# EAGLE design K84 (EAGLE 8.4.1)
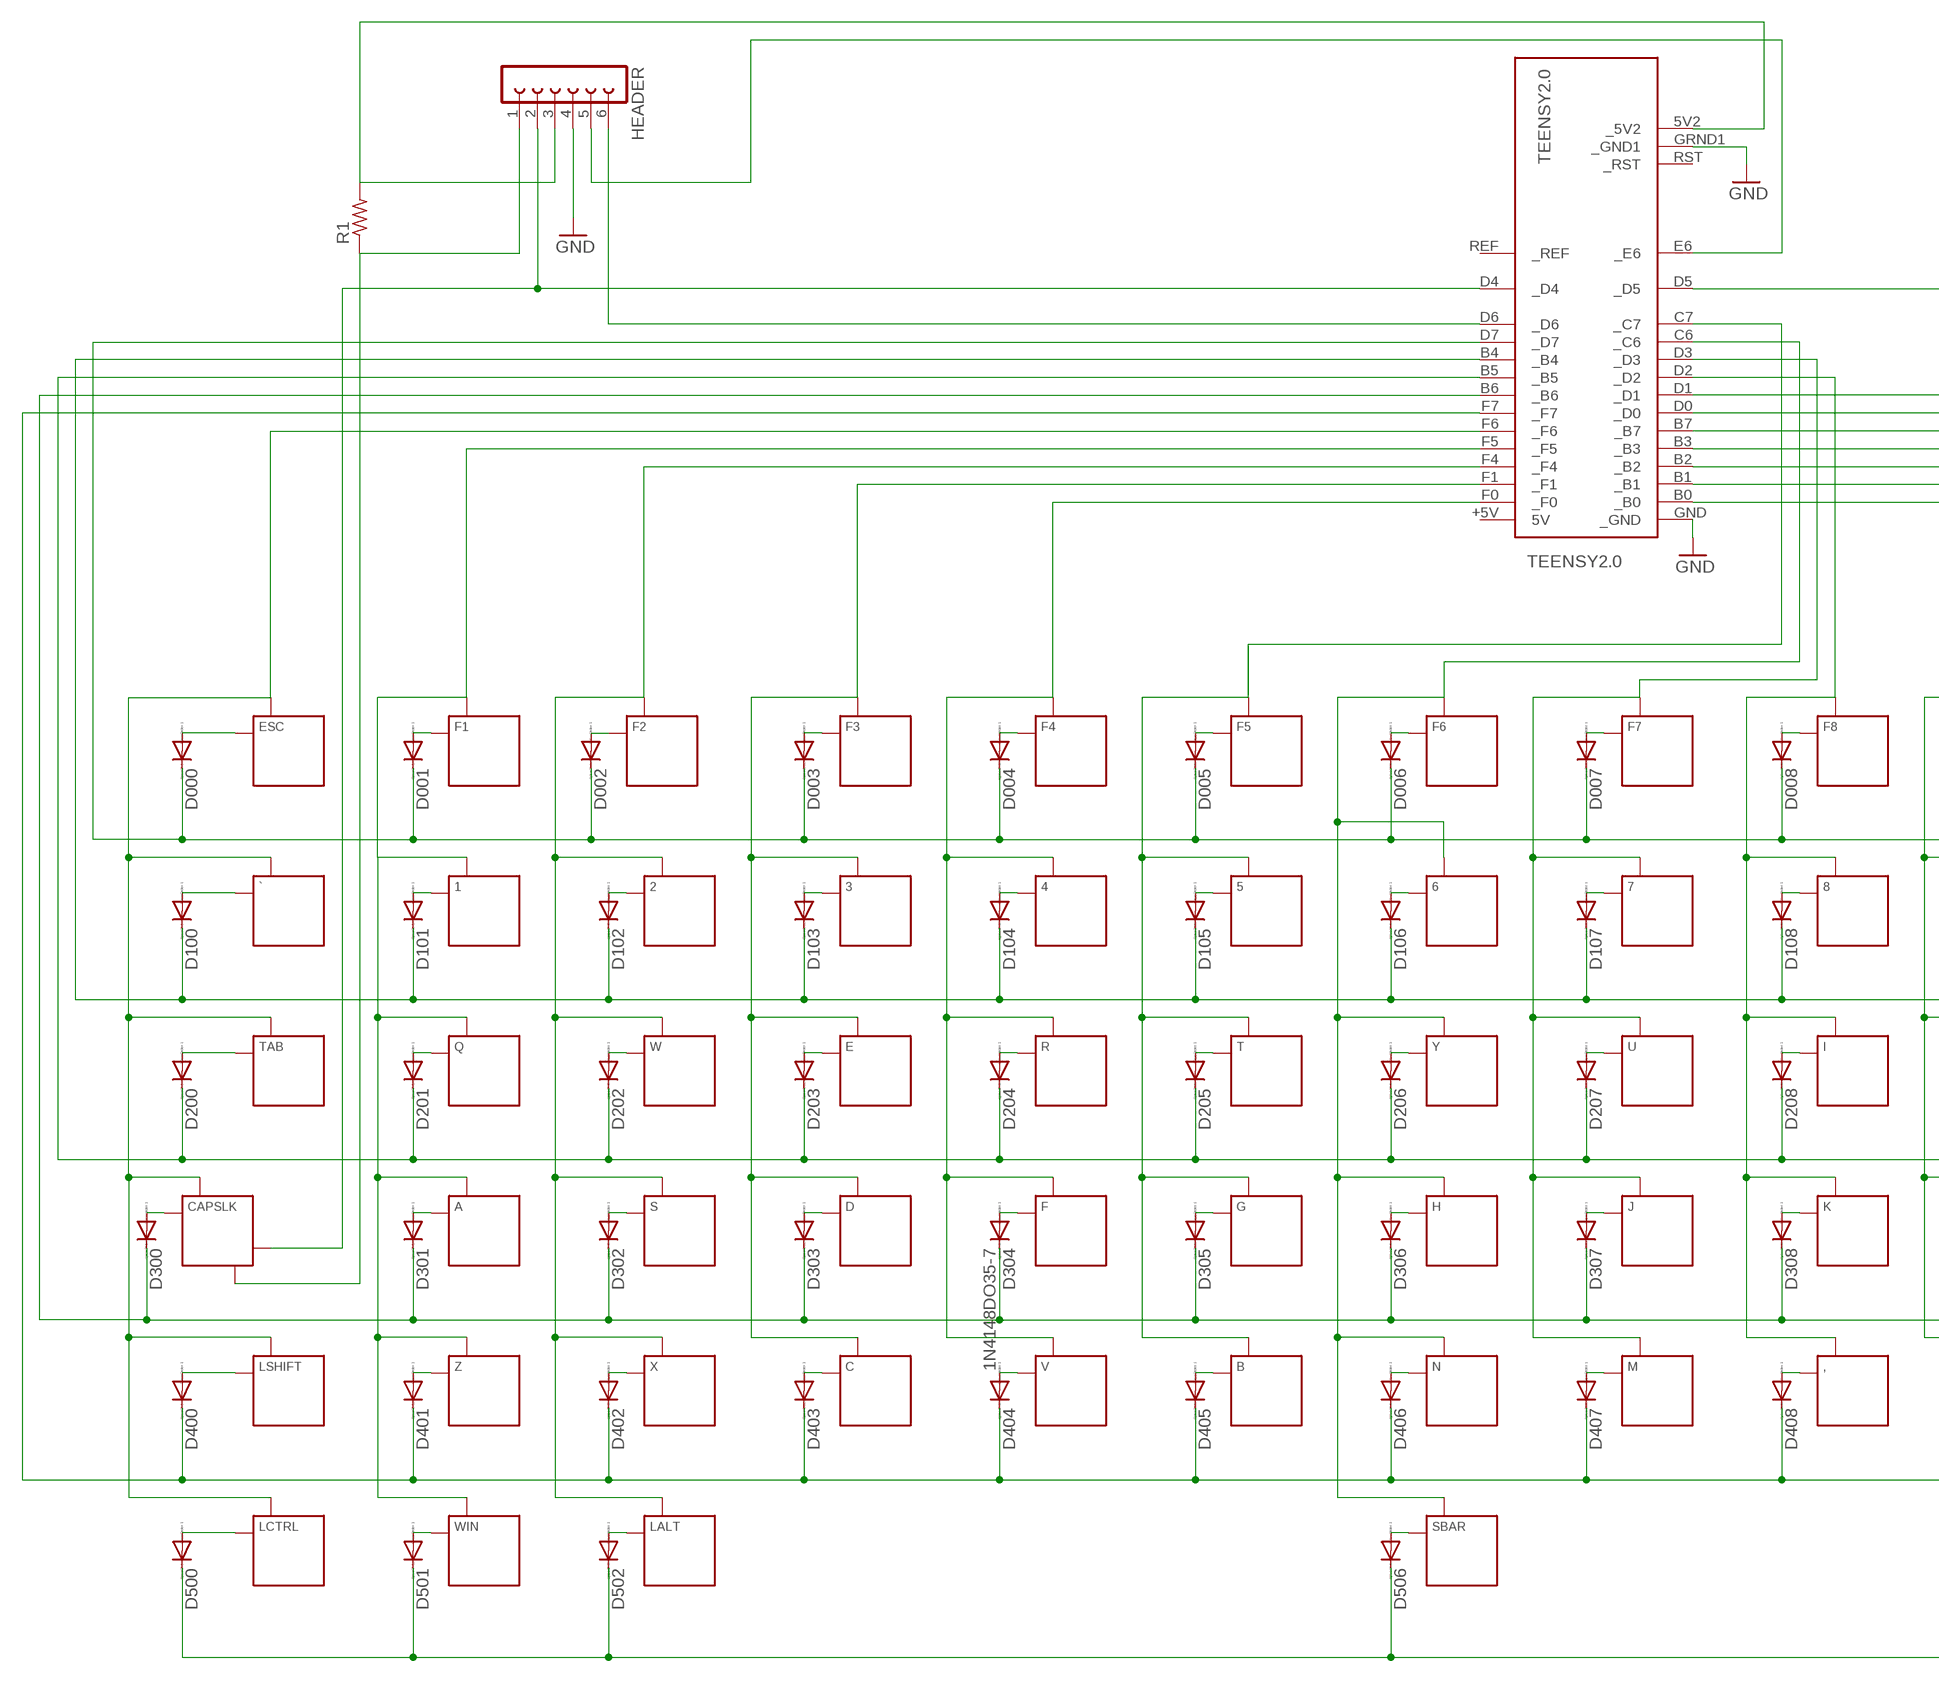
[diagram p0: schematic, sheet 1, part 1 of 2]
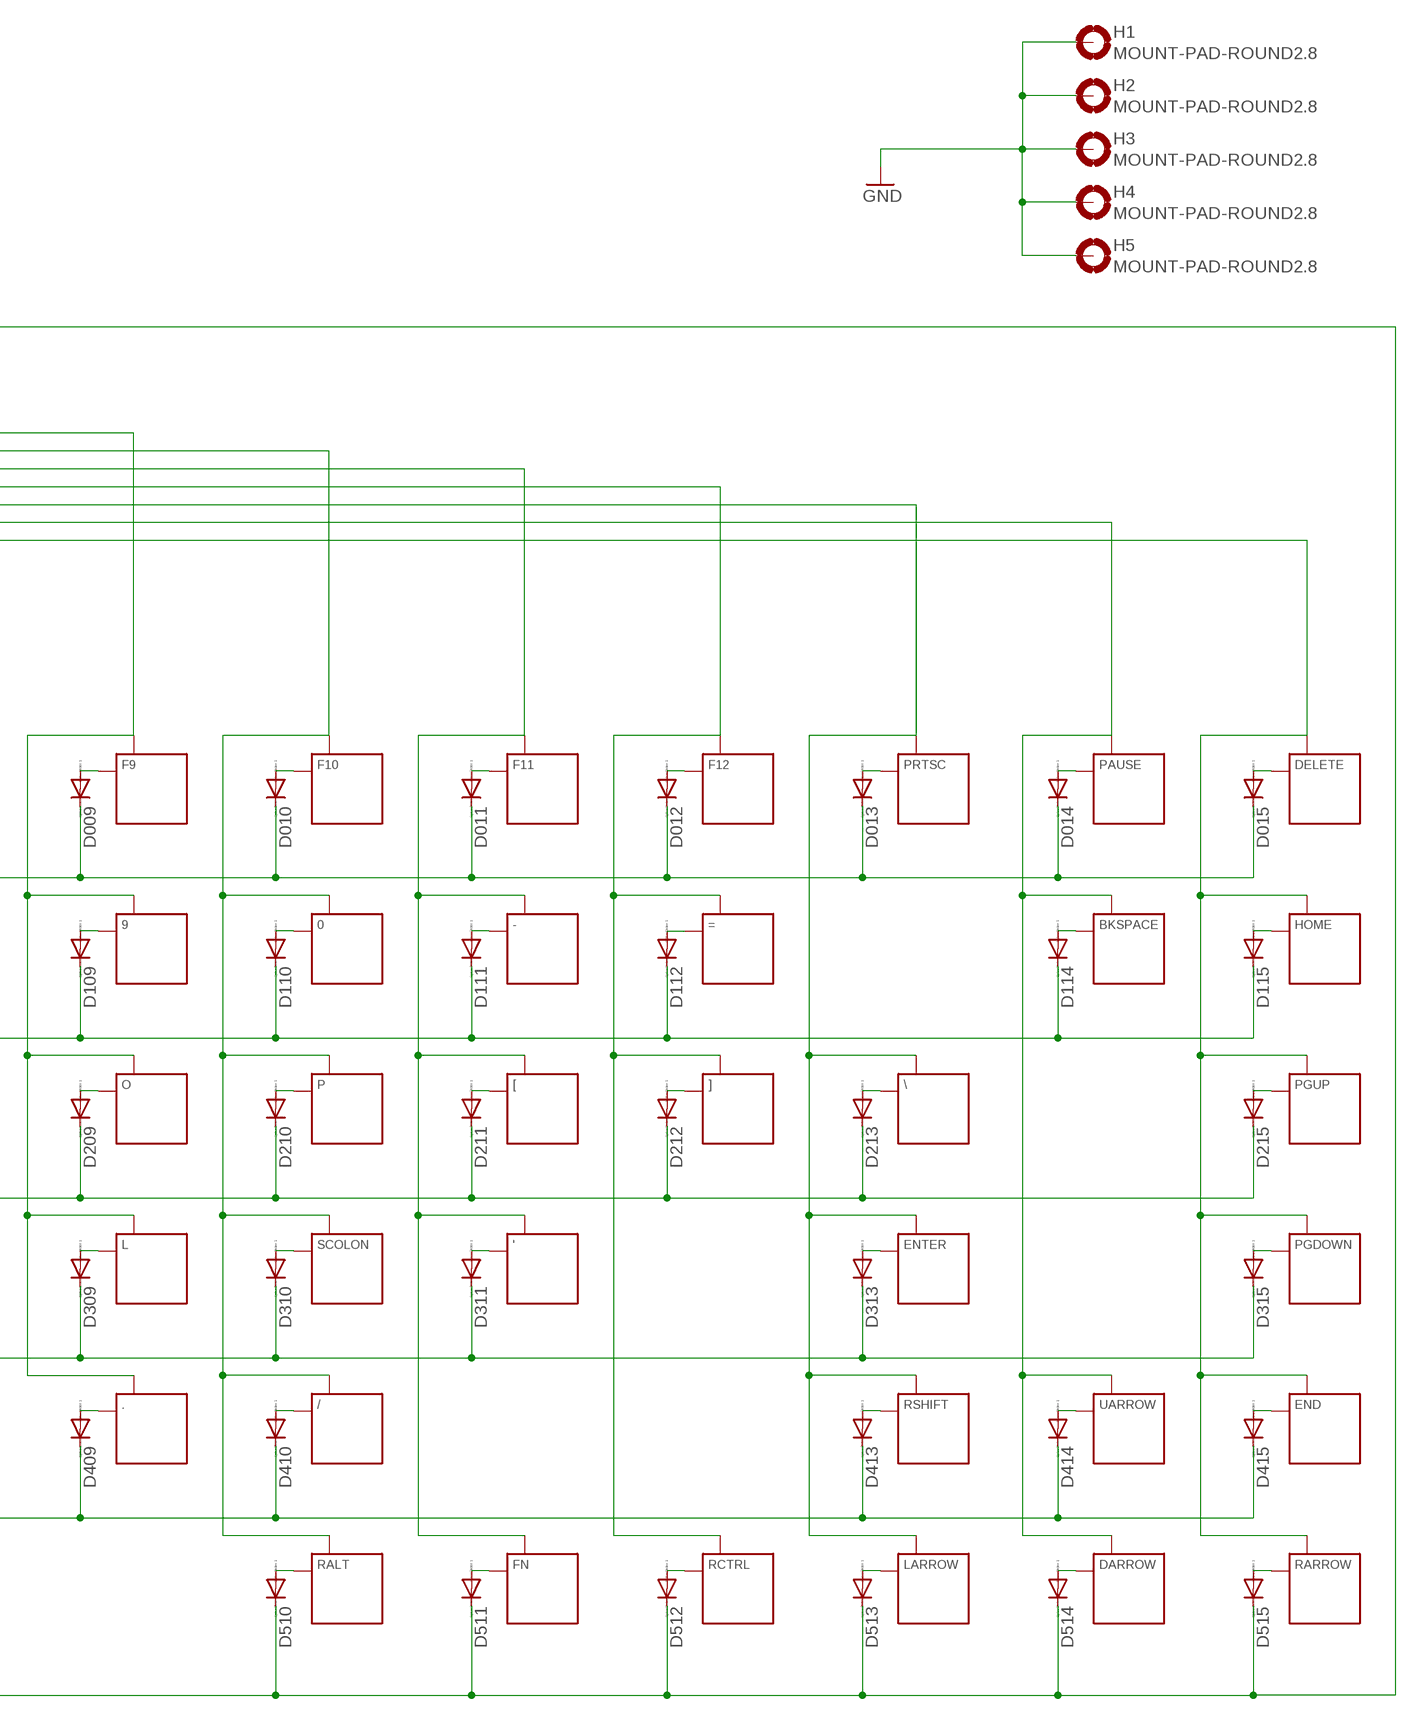
[diagram p1: schematic, sheet 1, part 2 of 2]

## Parts
0  KEYSWITCH-PLAIN-MX-1U  [MX-1U]
1  KEYSWITCH-PLAIN-MX-1U  [MX-1U]
2  KEYSWITCH-PLAIN-MX-1U  [MX-1U]
3  KEYSWITCH-PLAIN-MX-1U  [MX-1U]
4  KEYSWITCH-PLAIN-MX-1U  [MX-1U]
5  KEYSWITCH-PLAIN-MX-1U  [MX-1U]
6  KEYSWITCH-PLAIN-MX-1U  [MX-1U]
7  KEYSWITCH-PLAIN-MX-1U  [MX-1U]
8  KEYSWITCH-PLAIN-MX-1U  [MX-1U]
9  KEYSWITCH-PLAIN-MX-1U  [MX-1U]
'  KEYSWITCH-PLAIN-MX-1U  [MX-1U]
,  KEYSWITCH-PLAIN-MX-1U  [MX-1U]
-  KEYSWITCH-PLAIN-MX-1U  [MX-1U]
.  KEYSWITCH-PLAIN-MX-1U  [MX-1U]
/  KEYSWITCH-PLAIN-MX-1U  [MX-1U]
=  KEYSWITCH-PLAIN-MX-1U  [MX-1U]
[  KEYSWITCH-PLAIN-MX-1U  [MX-1U]
\\  KEYSWITCH-PLAIN-MX-1U  [MX-1U]
]  KEYSWITCH-PLAIN-MX-1U  [MX-1U]
`  KEYSWITCH-PLAIN-MX-1U  [MX-1U]
A  KEYSWITCH-PLAIN-MX-1U  [MX-1U]
B  KEYSWITCH-PLAIN-MX-1U  [MX-1U]
BKSPACE  KEYSWITCH-PLAIN-MX-2U  [MX-2U]
C  KEYSWITCH-PLAIN-MX-1U  [MX-1U]
CAPSLK  KEYSWITCH-LED-MX-1U-LED  [MX-1U-LED]
D  KEYSWITCH-PLAIN-MX-1U  [MX-1U]
D000  1N4148DO35-7  [DO35-7]
D001  1N4148DO35-7  [DO35-7]
D002  1N4148DO35-7  [DO35-7]
D003  1N4148DO35-7  [DO35-7]
D004  1N4148DO35-7  [DO35-7]
D005  1N4148DO35-7  [DO35-7]
D006  1N4148DO35-7  [DO35-7]
D007  1N4148DO35-7  [DO35-7]
D008  1N4148DO35-7  [DO35-7]
D009  1N4148DO35-7  [DO35-7]
D010  1N4148DO35-7  [DO35-7]
D011  1N4148DO35-7  [DO35-7]
D012  1N4148DO35-7  [DO35-7]
D013  1N4148DO35-7  [DO35-7]
D014  1N4148DO35-7  [DO35-7]
D015  1N4148DO35-7  [DO35-7]
D100  1N4148DO35-7  [DO35-7]
D101  1N4148DO35-7  [DO35-7]
D102  1N4148DO35-7  [DO35-7]
D103  1N4148DO35-7  [DO35-7]
D104  1N4148DO35-7  [DO35-7]
D105  1N4148DO35-7  [DO35-7]
D106  1N4148DO35-7  [DO35-7]
D107  1N4148DO35-7  [DO35-7]
D108  1N4148DO35-7  [DO35-7]
D109  1N4148DO35-7  [DO35-7]
D110  1N4148DO35-7  [DO35-7]
D111  1N4148DO35-7  [DO35-7]
D112  1N4148DO35-7  [DO35-7]
D114  1N4148DO35-7  [DO35-7]
D115  1N4148DO35-7  [DO35-7]
D200  1N4148DO35-7  [DO35-7]
D201  1N4148DO35-7  [DO35-7]
D202  1N4148DO35-7  [DO35-7]
D203  1N4148DO35-7  [DO35-7]
D204  1N4148DO35-7  [DO35-7]
D205  1N4148DO35-7  [DO35-7]
D206  1N4148DO35-7  [DO35-7]
D207  1N4148DO35-7  [DO35-7]
D208  1N4148DO35-7  [DO35-7]
D209  1N4148DO35-7  [DO35-7]
D210  1N4148DO35-7  [DO35-7]
D211  1N4148DO35-7  [DO35-7]
D212  1N4148DO35-7  [DO35-7]
D213  1N4148DO35-7  [DO35-7]
D215  1N4148DO35-7  [DO35-7]
D300  1N4148DO35-7  [DO35-7]
D301  1N4148DO35-7  [DO35-7]
D302  1N4148DO35-7  [DO35-7]
D303  1N4148DO35-7  [DO35-7]
D304  1N4148DO35-7  [DO35-7]
D305  1N4148DO35-7  [DO35-7]
D306  1N4148DO35-7  [DO35-7]
D307  1N4148DO35-7  [DO35-7]
D308  1N4148DO35-7  [DO35-7]
D309  1N4148DO35-7  [DO35-7]
D310  1N4148DO35-7  [DO35-7]
D311  1N4148DO35-7  [DO35-7]
D313  1N4148DO35-7  [DO35-7]
D315  1N4148DO35-7  [DO35-7]
D400  1N4148DO35-7  [DO35-7]
D401  1N4148DO35-7  [DO35-7]
D402  1N4148DO35-7  [DO35-7]
D403  1N4148DO35-7  [DO35-7]
D404  1N4148DO35-7  [DO35-7]
D405  1N4148DO35-7  [DO35-7]
D406  1N4148DO35-7  [DO35-7]
D407  1N4148DO35-7  [DO35-7]
D408  1N4148DO35-7  [DO35-7]
D409  1N4148DO35-7  [DO35-7]
D410  1N4148DO35-7  [DO35-7]
D413  1N4148DO35-7  [DO35-7]
D414  1N4148DO35-7  [DO35-7]
D415  1N4148DO35-7  [DO35-7]
D500  1N4148DO35-7  [DO35-7]
D501  1N4148DO35-7  [DO35-7]
D502  1N4148DO35-7  [DO35-7]
D506  1N4148DO35-7  [DO35-7]
D510  1N4148DO35-7  [DO35-7]
D511  1N4148DO35-7  [DO35-7]
D512  1N4148DO35-7  [DO35-7]
D513  1N4148DO35-7  [DO35-7]
D514  1N4148DO35-7  [DO35-7]
D515  1N4148DO35-7  [DO35-7]
DARROW  KEYSWITCH-PLAIN-MX-1U  [MX-1U]
DELETE  KEYSWITCH-PLAIN-MX-1U  [MX-1U]
E  KEYSWITCH-PLAIN-MX-1U  [MX-1U]
END  KEYSWITCH-PLAIN-MX-1U  [MX-1U]
ENTER  KEYSWITCH-PLAIN-MX-2U  [MX-2U]
ESC  S001  KEYSWITCH-PLAIN-MX-1U  [MX-1U]
F  KEYSWITCH-PLAIN-MX-1U  [MX-1U]
F1  KEYSWITCH-PLAIN-MX-1U  [MX-1U]
F2  KEYSWITCH-PLAIN-MX-1U  [MX-1U]
F3  KEYSWITCH-PLAIN-MX-1U  [MX-1U]
F4  KEYSWITCH-PLAIN-MX-1U  [MX-1U]
F5  KEYSWITCH-PLAIN-MX-1U  [MX-1U]
F6  KEYSWITCH-PLAIN-MX-1U  [MX-1U]
F7  KEYSWITCH-PLAIN-MX-1U  [MX-1U]
F8  KEYSWITCH-PLAIN-MX-1U  [MX-1U]
F9  KEYSWITCH-PLAIN-MX-1U  [MX-1U]
F10  KEYSWITCH-PLAIN-MX-1U  [MX-1U]
F11  KEYSWITCH-PLAIN-MX-1U  [MX-1U]
F12  KEYSWITCH-PLAIN-MX-1U  [MX-1U]
FN  KEYSWITCH-PLAIN-MX-1U  [MX-1U]
G  KEYSWITCH-PLAIN-MX-1U  [MX-1U]
H  KEYSWITCH-PLAIN-MX-1U  [MX-1U]
H1  MOUNT-PAD-ROUND2.8  [2,8-PAD]
H2  MOUNT-PAD-ROUND2.8  [2,8-PAD]
H3  MOUNT-PAD-ROUND2.8  [2,8-PAD]
H4  MOUNT-PAD-ROUND2.8  [2,8-PAD]
H5  MOUNT-PAD-ROUND2.8  [2,8-PAD]
HEADER  FE06-1  [FE06]
HOME  KEYSWITCH-PLAIN-MX-1U  [MX-1U]
I  KEYSWITCH-PLAIN-MX-1U  [MX-1U]
J  KEYSWITCH-PLAIN-MX-1U  [MX-1U]
K  KEYSWITCH-PLAIN-MX-1U  [MX-1U]
L  KEYSWITCH-PLAIN-MX-1U  [MX-1U]
LALT  KEYSWITCH-PLAIN-MX-1U  [MX-1U]
LARROW  KEYSWITCH-PLAIN-MX-1U  [MX-1U]
LCTRL  KEYSWITCH-PLAIN-MX-1U  [MX-1U]
LSHIFT  KEYSWITCH-PLAIN-MX-2U  [MX-2U]
M  KEYSWITCH-PLAIN-MX-1U  [MX-1U]
N  KEYSWITCH-PLAIN-MX-1U  [MX-1U]
O  KEYSWITCH-PLAIN-MX-1U  [MX-1U]
P  KEYSWITCH-PLAIN-MX-1U  [MX-1U]
PAUSE  KEYSWITCH-PLAIN-MX-1U  [MX-1U]
PGDOWN  KEYSWITCH-PLAIN-MX-1U  [MX-1U]
PGUP  KEYSWITCH-PLAIN-MX-1U  [MX-1U]
PRTSC  KEYSWITCH-PLAIN-MX-1U  [MX-1U]
Q  KEYSWITCH-PLAIN-MX-1U  [MX-1U]
R  KEYSWITCH-PLAIN-MX-1U  [MX-1U]
R1  R-US_0204/7  [0204/7]
RALT  KEYSWITCH-PLAIN-MX-1U  [MX-1U]
RARROW  KEYSWITCH-PLAIN-MX-1U  [MX-1U]
RCTRL  KEYSWITCH-PLAIN-MX-1U  [MX-1U]
RSHIFT  KEYSWITCH-PLAIN-MX-1U  [MX-1U]
S  KEYSWITCH-PLAIN-MX-1U  [MX-1U]
SBAR  KEYSWITCH-PLAIN-MX-6.25U-FLIPPED  [MX-6.25U-FLIPPED]
SCOLON  KEYSWITCH-PLAIN-MX-1U  [MX-1U]
T  KEYSWITCH-PLAIN-MX-1U  [MX-1U]
TAB  KEYSWITCH-PLAIN-MX-1U  [MX-1U]
TEENSY2.0  TEENSY2.0  [TEENSY2.0]
U  KEYSWITCH-PLAIN-MX-1U  [MX-1U]
UARROW  KEYSWITCH-PLAIN-MX-1U  [MX-1U]
V  KEYSWITCH-PLAIN-MX-1U  [MX-1U]
W  KEYSWITCH-PLAIN-MX-1U  [MX-1U]
WIN  KEYSWITCH-PLAIN-MX-1U  [MX-1U]
X  KEYSWITCH-PLAIN-MX-1U  [MX-1U]
Y  KEYSWITCH-PLAIN-MX-1U  [MX-1U]
Z  KEYSWITCH-PLAIN-MX-1U  [MX-1U]

## Nets
5V2: HEADER.3 R1.2 TEENSY2.0.5V2(_5V2)
B0: DELETE.MX2(P1) END.MX2(P1) HOME.MX2(P1) PGDOWN.MX2(P1) PGUP.MX2(P1) RARROW.MX2(P1) TEENSY2.0.B0(_B0)
B1: BKSPACE.MX2(P1) DARROW.MX2(P1) PAUSE.MX2(P1) TEENSY2.0.B1(_B1) UARROW.MX2(P1)
B2: \\.MX2(P1) ENTER.MX2(P1) LARROW.MX2(P1) PRTSC.MX2(P1) RSHIFT.MX2(P1) TEENSY2.0.B2(_B2)
B3: =.MX2(P1) ].MX2(P1) F12.MX2(P1) RCTRL.MX2(P1) TEENSY2.0.B3(_B3)
B4: D100.C D101.C D102.C D103.C D104.C D105.C D106.C D107.C D108.C D109.C D110.C D111.C D112.C D114.C D115.C TEENSY2.0.B4(_B4)
B5: D200.C D201.C D202.C D203.C D204.C D205.C D206.C D207.C D208.C D209.C D210.C D211.C D212.C D213.C D215.C TEENSY2.0.B5(_B5)
B6: D300.C D301.C D302.C D303.C D304.C D305.C D306.C D307.C D308.C D309.C D310.C D311.C D313.C D315.C TEENSY2.0.B6(_B6)
B7: '.MX2(P1) -.MX2(P1) [.MX2(P1) F11.MX2(P1) FN.MX2(P1) TEENSY2.0.B7(_B7)
C6: 6.MX2(P1) F6.MX2(P1) H.MX2(P1) N.MX2(P1) SBAR.MX2(P1) TEENSY2.0.C6(_C6) Y.MX2(P1)
C7: 5.MX2(P1) B.MX2(P1) F5.MX2(P1) G.MX2(P1) T.MX2(P1) TEENSY2.0.C7(_C7)
CAPS-LED+: CAPSLK.LED+ HEADER.1 R1.1
D0: 0.MX2(P1) /.MX2(P1) F10.MX2(P1) P.MX2(P1) RALT.MX2(P1) SCOLON.MX2(P1) TEENSY2.0.D0(_D0)
D1: 9.MX2(P1) ..MX2(P1) F9.MX2(P1) L.MX2(P1) O.MX2(P1) TEENSY2.0.D1(_D1)
D2: 8.MX2(P1) ,.MX2(P1) F8.MX2(P1) I.MX2(P1) K.MX2(P1) TEENSY2.0.D2(_D2)
D3: 7.MX2(P1) F7.MX2(P1) J.MX2(P1) M.MX2(P1) TEENSY2.0.D3(_D3) U.MX2(P1)
D4: CAPSLK.LED- HEADER.2 TEENSY2.0.D4(_D4)
D5: D500.C D501.C D502.C D506.C D510.C D511.C D512.C D513.C D514.C D515.C TEENSY2.0.D5(_D5)
D7: D000.C D001.C D002.C D003.C D004.C D005.C D006.C D007.C D008.C D009.C D010.C D011.C D012.C D013.C D014.C D015.C TEENSY2.0.D7(_D7)
F0: 4.MX2(P1) F4.MX2(P1) F.MX2(P1) R.MX2(P1) TEENSY2.0.F0(_F0) V.MX2(P1)
F1: 3.MX2(P1) C.MX2(P1) D.MX2(P1) E.MX2(P1) F3.MX2(P1) TEENSY2.0.F1(_F1)
F4: 2.MX2(P1) F2.MX2(P1) LALT.MX2(P1) S.MX2(P1) TEENSY2.0.F4(_F4) W.MX2(P1) X.MX2(P1)
F5: 1.MX2(P1) A.MX2(P1) F1.MX2(P1) Q.MX2(P1) TEENSY2.0.F5(_F5) WIN.MX2(P1) Z.MX2(P1)
F6: `.MX2(P1) CAPSLK.MX2(P1) ESC.MX2(P1) LCTRL.MX2(P1) LSHIFT.MX2(P1) TAB.MX2(P1) TEENSY2.0.F6(_F6)
F7: D400.C D401.C D402.C D403.C D404.C D405.C D406.C D407.C D408.C D409.C D410.C D413.C D414.C D415.C TEENSY2.0.F7(_F7)
GND: H1.B2,8(MOUNT) H2.B2,8(MOUNT) H3.B2,8(MOUNT) H4.B2,8(MOUNT) H5.B2,8(MOUNT) HEADER.4 TEENSY2.0.GND(_GND) TEENSY2.0.GRND1(_GND1)
N$1: D000.A ESC.MX1(P0)
N$2: D001.A F1.MX1(P0)
N$3: D002.A F2.MX1(P0)
N$4: D115.A HOME.MX1(P0)
N$5: D003.A F3.MX1(P0)
N$6: D004.A F4.MX1(P0)
N$7: `.MX1(P0) D100.A
N$8: D011.A F11.MX1(P0)
N$9: D005.A F5.MX1(P0)
N$10: D006.A F6.MX1(P0)
N$11: D007.A F7.MX1(P0)
N$12: D008.A F8.MX1(P0)
N$13: D009.A F9.MX1(P0)
N$14: D013.A PRTSC.MX1(P0)
N$15: D010.A F10.MX1(P0)
N$16: 1.MX1(P0) D101.A
N$17: D012.A F12.MX1(P0)
N$18: D014.A PAUSE.MX1(P0)
N$19: 2.MX1(P0) D102.A
N$20: D015.A DELETE.MX1(P0)
N$21: 3.MX1(P0) D103.A
N$22: 7.MX1(P0) D107.A
N$23: 4.MX1(P0) D104.A
N$24: 5.MX1(P0) D105.A
N$25: 6.MX1(P0) D106.A
N$26: 8.MX1(P0) D108.A
N$27: 9.MX1(P0) D109.A
N$28: 0.MX1(P0) D110.A
N$29: -.MX1(P0) D111.A
N$30: =.MX1(P0) D112.A
N$31: BKSPACE.MX1(P0) D114.A
N$32: D201.A Q.MX1(P0)
N$33: D200.A TAB.MX1(P0)
N$35: D308.A K.MX1(P0)
N$36: D202.A W.MX1(P0)
N$37: D302.A S.MX1(P0)
N$38: A.MX1(P0) D301.A
N$39: D402.A X.MX1(P0)
N$40: D401.A Z.MX1(P0)
N$42: C.MX1(P0) D403.A
N$43: D304.A F.MX1(P0)
N$44: D204.A R.MX1(P0)
N$45: D404.A V.MX1(P0)
N$46: B.MX1(P0) D405.A
N$47: D305.A G.MX1(P0)
N$48: D303.A D.MX1(P0)
N$49: D205.A T.MX1(P0)
N$50: D206.A Y.MX1(P0)
N$51: D207.A U.MX1(P0)
N$52: D307.A J.MX1(P0)
N$53: D407.A M.MX1(P0)
N$54: D406.A N.MX1(P0)
N$55: D306.A H.MX1(P0)
N$56: D208.A I.MX1(P0)
N$57: D209.A O.MX1(P0)
N$58: D309.A L.MX1(P0)
N$59: ..MX1(P0) D409.A
N$60: ,.MX1(P0) D408.A
N$61: /.MX1(P0) D410.A
N$62: D310.A SCOLON.MX1(P0)
N$63: D210.A P.MX1(P0)
N$64: [.MX1(P0) D211.A
N$65: '.MX1(P0) D311.A
N$66: D400.A LSHIFT.MX1(P0)
N$67: ].MX1(P0) D212.A
N$68: \\.MX1(P0) D213.A
N$69: D313.A ENTER.MX1(P0)
N$70: D215.A PGUP.MX1(P0)
N$71: D315.A PGDOWN.MX1(P0)
N$72: D415.A END.MX1(P0)
N$73: D414.A UARROW.MX1(P0)
N$74: D515.A RARROW.MX1(P0)
N$75: D514.A DARROW.MX1(P0)
N$76: D513.A LARROW.MX1(P0)
N$77: D413.A RSHIFT.MX1(P0)
N$78: D512.A RCTRL.MX1(P0)
N$79: D511.A FN.MX1(P0)
N$80: D510.A RALT.MX1(P0)
N$81: CAPSLK.MX1(P0) D300.A
N$84: D203.A E.MX1(P0)
N$85: HEADER.6 TEENSY2.0.D6(_D6)
N$86: HEADER.5 TEENSY2.0.E6(_E6)
N$87: D500.A LCTRL.MX1(P0)
N$88: D501.A WIN.MX1(P0)
N$89: D502.A LALT.MX1(P0)
N$90: D506.A SBAR.MX1(P0)
Unconnected: TEENSY2.0.+5V(5V) TEENSY2.0.REF(_REF) TEENSY2.0.RST(_RST)

## Library data of the parts
0 1-9 ' , - . / = [ \\ ] ` A B BKSPACE C D DARROW DELETE E END ENTER ESC F F1-F12 FN G H HOME I J K L LALT LARROW LCTRL LSHIFT M N O P PAUSE PGDOWN PGUP PRTSC Q R RALT RARROW RCTRL RSHIFT S SBAR SCOLON T TAB U UARROW V W WIN X Y Z = Keyboard:KEYSWITCH-PLAIN
CAPSLK = Keyboard:KEYSWITCH-LED
D000 D001-D009 D010-D015 D100-D112 D114 D115 D200-D213 D215 D300-D311 D313 D315 D400-D410 D413-D415 D500-D502 D506 D510-D515 = diode:1N4148: DIODE high speed (Philips)
H1-H5 = con-haxn:MOUNT-PAD-ROUND: MOUNTING PAD, round
HEADER = con-lsta:FE06-1: FEMALE HEADER; OC_FARNELL: unknown; OC_NEWARK: unknown
R1 = resistor:R-US_: RESISTOR, American symbol
TEENSY2.0 = teensy:TEENSY2.0: Teensy 2.0

## Board
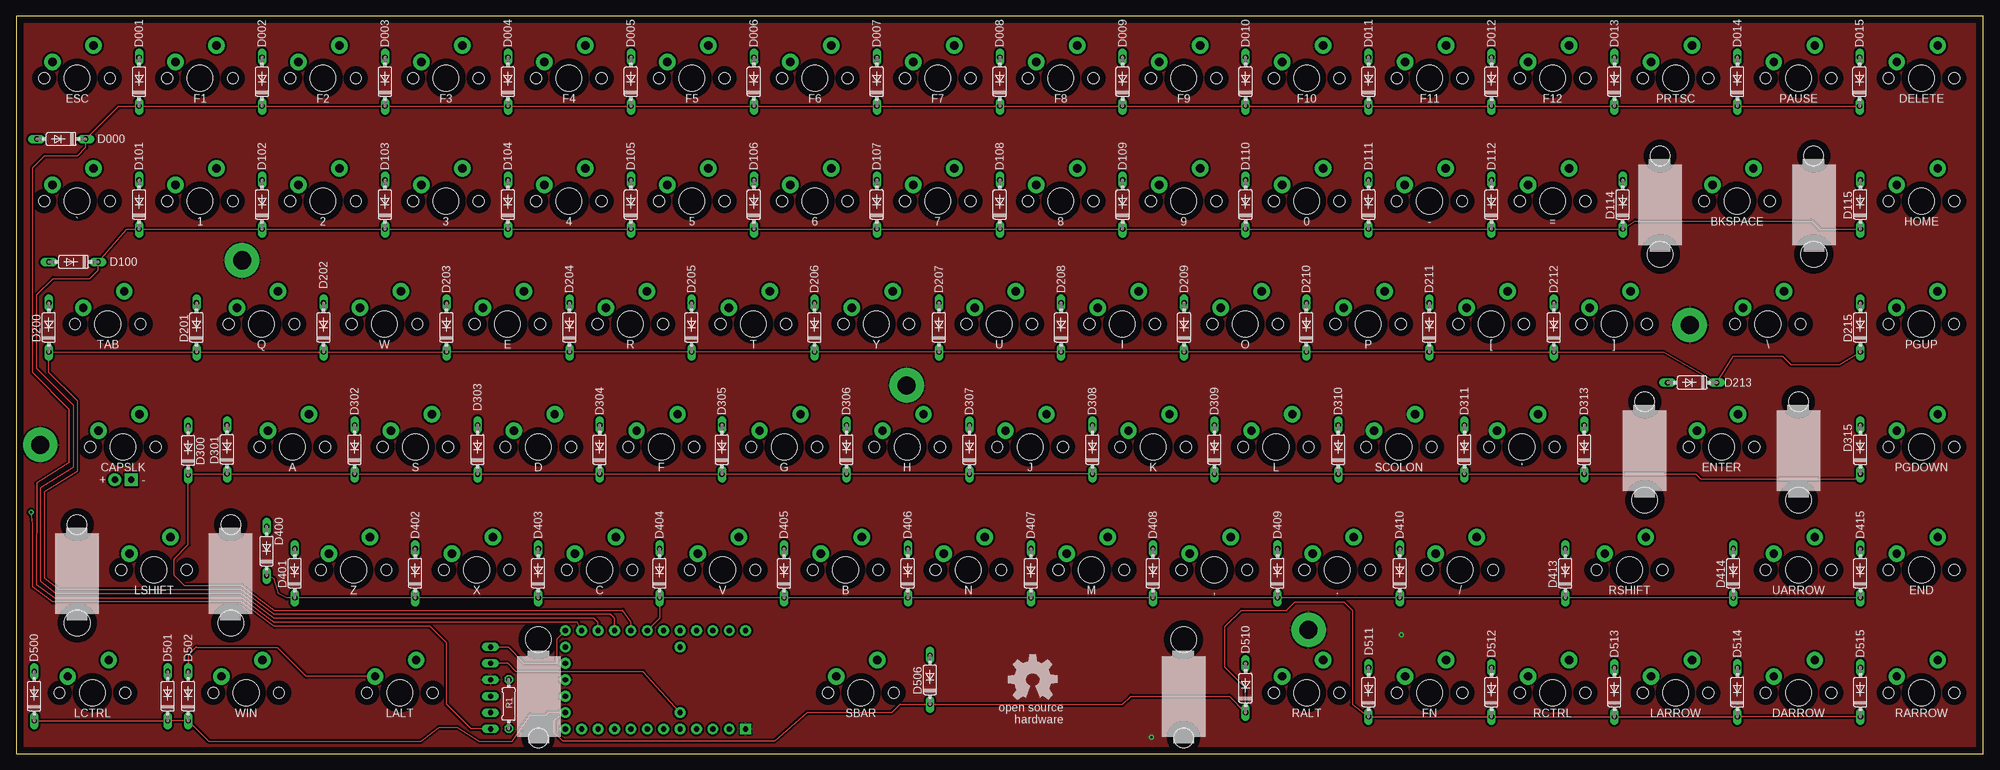
[diagram p2: board, top side]
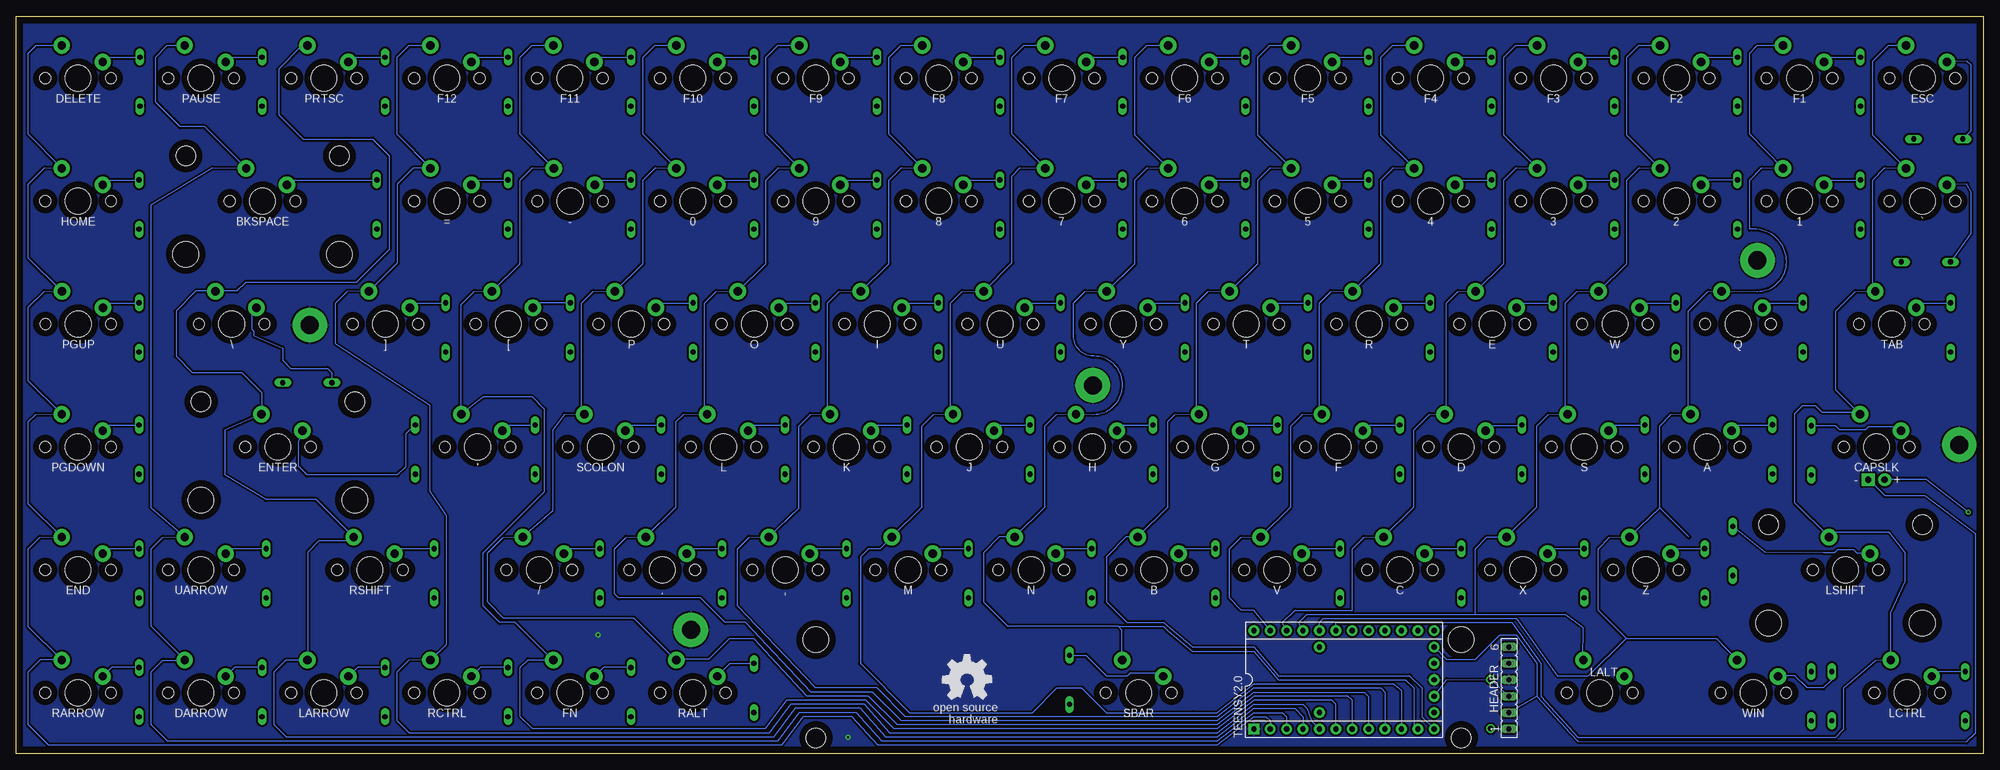
[diagram p3: board, bottom side, seen from below]

Size 304.8 x 114.3 mm. Coordinates in mm from the lower left corner, seen from the top.
Outline: 0,114.3 0,0 304.8,0 304.8,114.3 0,114.3
Copper layers (1*16): Top 0.035mm / dielectric 1.5mm / Bottom 0.035mm
Design rules "default": minimum track width 6mil, minimum drill 0.35mm, track to track 6mil, track to pad 6mil, pad to pad 6mil, via to via 6mil, smd to smd 6mil, copper to edge 40mil, drill to drill 6mil, minimum pad ring 10mil, minimum via ring 8mil, stop-mask expansion 4mil, vias tented up to drill 0mil, thermal gap 10mil

### Footprints (pad centres in the part's own frame; a part is rotated, then mirrored left to right if it is on the bottom)
MX-1U = drill 1.3 pad 2.54: MX1 -3.81,2.54; MX2 2.54,5.08 | hole 4: 0,0 | hole 1.7: -5.08,0; 5.08,0
MX-2U = drill 1.3 pad 2.54: MX1 -3.81,2.54; MX2 2.54,5.08 | hole 4: 0,0; -11.9,-8.24; 11.9,-8.24 | hole 1.7: -5.08,0; 5.08,0 | hole 3.05: -11.9,7; 11.9,7
MX-1U-LED = drill 1 pad 2: LED+ -1.27,-5.08 | drill 1 pad 2 square: LED- 1.27,-5.08 | drill 1.3 pad 2.54: MX1 -3.81,2.54; MX2 2.54,5.08 | hole 4: 0,0 | hole 1.7: -5.08,0; 5.08,0
DO35-7 = drill 0.813 long: A 3.81,0; C -3.81,0
2,8-PAD = drill 2.8 pad 5.334: B2,8 0,0
FE06 = drill 0.813 long: 1 -6.35,0; 2 -3.81,0; 3 -1.27,0; 4 1.27,0; 5 3.81,0; 6 6.35,0
0204/7 = drill 0.813 octagon: 1 -3.81,0; 2 3.81,0
MX-6.25U-FLIPPED = drill 1.3 pad 2.54: MX1 -3.81,2.54; MX2 2.54,5.08 | hole 4: 0,0; -50,8.24; 50,8.24 | hole 1.7: -5.08,0; 5.08,0 | hole 3.05: -50,-7; 50,-7
TEENSY2.0 = drill 0.813 pad 1.676: 5V2 13.97,-2.54; +5V -13.97,7.62; B0 -11.43,-7.62; B1 -8.89,-7.62; B2 -6.35,-7.62; B3 -3.81,-7.62; B4 8.89,7.62; B5 6.35,7.62; B6 3.81,7.62; B7 -1.27,-7.62; C6 11.43,-7.62; C7 13.97,-7.62; D0 1.27,-7.62; D1 3.81,-7.62; D2 6.35,-7.62; D3 8.89,-7.62; D4 13.97,5.08; D5 13.97,-5.08; D6 13.97,7.62; D7 11.43,7.62; E6 -3.81,-5.08; F0 -11.43,7.62; F1 -8.89,7.62; F4 -6.35,7.62; F5 -3.81,7.62; F6 -1.27,7.62; F7 1.27,7.62; GRND1 13.97,0; REF -3.81,5.08; RST 13.97,2.54 | drill 0.813 pad 1.676 square: GND -13.97,-7.62

### Placement (x,y rotation side)
0  199.95,85.62 0 top
1  28.5,85.62 0 top
2  47.55,85.62 0 top
3  66.6,85.62 0 top
4  85.65,85.62 0 top
5  104.7,85.62 0 top
6  123.75,85.62 0 top
7  142.8,85.62 0 top
8  161.85,85.62 0 top
9  180.9,85.62 0 top
'  233.3,47.52 0 top
,  185.65,28.47 0 top
-  218.97,85.62 0 top
.  204.7,28.47 0 top
/  223.75,28.47 0 top
=  238.05,85.62 0 top
[  228.52,66.57 0 top
\\  271.4,66.57 0 top
]  247.57,66.57 0 top
`  9.45,85.62 0 top
A  42.8,47.52 0 top
B  128.5,28.47 0 top
BKSPACE  266.62,85.62 0 top
C  90.4,28.47 0 top
CAPSLK  16.56,47.52 0 top
D  80.9,47.52 0 top
D000  6.99,95.25 180 top
D001  19.05,104.14 90 top
D002  38.1,104.14 90 top
D003  57.15,104.14 90 top
D004  76.2,104.14 90 top
D005  95.25,104.14 90 top
D006  114.3,104.14 90 top
D007  133.35,104.14 90 top
D008  152.4,104.14 90 top
D009  171.45,104.14 90 top
D010  190.5,104.14 90 top
D011  209.55,104.14 90 top
D012  228.6,104.14 90 top
D013  247.65,104.14 90 top
D014  266.7,104.14 90 top
D015  285.62,104.14 90 top
D100  8.89,76.2 180 top
D101  19.05,85.09 90 top
D102  38.1,85.09 90 top
D103  57.15,85.09 90 top
D104  76.2,85.09 90 top
D105  95.25,85.09 90 top
D106  114.3,85.09 90 top
D107  133.35,85.09 90 top
D108  152.4,85.09 90 top
D109  171.45,85.09 90 top
D110  190.5,85.09 90 top
D111  209.55,85.09 90 top
D112  228.6,85.09 90 top
D114  248.92,85.09 90 top
D115  285.75,85.09 90 top
D200  5.08,66.04 90 top
D201  27.94,66.04 90 top
D202  47.62,66.04 90 top
D203  66.67,66.04 90 top
D204  85.72,66.04 90 top
D205  104.65,66.04 90 top
D206  123.7,66.04 90 top
D207  143,66.04 90 top
D208  161.93,66.04 90 top
D209  180.97,66.04 90 top
D210  199.9,66.04 90 top
D211  218.95,66.04 90 top
D212  238.25,66.04 90 top
D213  259.69,57.48 180 top
D215  285.75,66.04 90 top
D300  26.67,46.99 90 top
D301  32.66,47.14 90 top
D302  52.45,47.12 90 top
D303  71.5,47.12 90 top
D304  90.42,47.12 90 top
D305  109.35,47.12 90 top
D306  128.65,47.12 90 top
D307  147.7,47.12 90 top
D308  166.75,47.12 90 top
D309  185.67,47.12 90 top
D310  204.85,47.12 90 top
D311  224.41,47.12 90 top
D313  242.95,47.12 90 top
D315  285.75,47.12 90 top
D400  38.84,31.39 90 top
D401  43.18,27.94 90 top
D402  61.85,27.94 90 top
D403  80.9,27.94 90 top
D404  99.69,27.94 90 top
D405  118.97,27.94 90 top
D406  138.15,27.94 90 top
D407  157.23,27.94 90 top
D408  176.15,27.94 90 top
D409  195.45,27.94 90 top
D410  214.38,27.94 90 top
D413  240.03,27.94 90 top
D414  266.06,27.94 90 top
D415  285.75,27.94 90 top
D500  2.79,8.89 90 top
D501  23.5,8.89 90 top
D502  26.67,8.89 90 top
D506  141.6,11.43 90 top
D510  190.5,10.16 90 top
D511  209.55,9.53 90 top
D512  228.6,9.53 90 top
D513  247.65,9.53 90 top
D514  266.7,9.53 90 top
D515  285.75,9.53 90 top
DARROW  276.15,9.42 0 top
DELETE  295.2,104.67 0 top
E  76.12,66.57 0 top
END  295.2,28.47 0 top
ENTER  264.24,47.52 0 top
ESC  9.45,104.67 0 top
F  99.95,47.52 0 top
F1  28.5,104.67 0 top
F2  47.55,104.67 0 top
F3  66.6,104.67 0 top
F4  85.65,104.67 0 top
F5  104.7,104.67 0 top
F6  123.75,104.67 0 top
F7  142.8,104.67 0 top
F8  161.85,104.67 0 top
F9  180.9,104.67 0 top
F10  199.95,104.67 0 top
F11  219,104.67 0 top
F12  238.05,104.67 0 top
FN  219,9.42 0 top
G  119,47.52 0 top
H  138.05,47.52 0 top
H1  3.73,47.85 0 top
H2  35,76.45 0 top
H3  137.97,57.07 0 top
H4  200.25,19.18 0 top
H5  259.31,66.42 0 top
HEADER  73.51,10.16 90 bottom
HOME  295.2,85.62 0 top
I  171.37,66.57 0 top
J  157.1,47.52 0 top
K  176.15,47.52 0 top
L  195.2,47.52 0 top
LALT  59.44,9.42 0 top
LARROW  257.1,9.42 0 top
LCTRL  11.81,9.42 0 top
LSHIFT  21.36,28.47 0 top
M  166.6,28.47 0 top
N  147.55,28.47 0 top
O  190.42,66.57 0 top
P  209.47,66.57 0 top
PAUSE  276.15,104.67 0 top
PGDOWN  295.2,47.52 0 top
PGUP  295.17,66.57 0 top
PRTSC  257.1,104.67 0 top
Q  38.02,66.57 0 top
R  95.17,66.57 0 top
R1  76.33,7.67 90 top
RALT  199.95,9.42 0 top
RARROW  295.2,9.42 0 top
RCTRL  238.05,9.42 0 top
RSHIFT  249.96,28.47 0 top
S  61.85,47.52 0 top
SBAR  130.89,9.42 0 top
SCOLON  214.25,47.52 0 top
T  114.22,66.57 0 top
TAB  14.2,66.57 0 top
TEENSY2.0  99.06,11.43 0 bottom
U  152.32,66.57 0 top
U$1  [OSHW_8MM]  157.48,11.43 0 top
U$2  [OSHW_8MM]  157.48,11.43 0 bottom
UARROW  276.15,28.47 0 top
V  109.45,28.47 0 top
W  57.07,66.57 0 top
WIN  35.64,9.42 0 top
X  71.35,28.47 0 top
Y  133.27,66.57 0 top
Z  52.3,28.47 0 top

### Tracks (layer width: path | path; a pad name or v marks a point on that pad's centre or on a via)
5V2
  Bottom 0.152: TEENSY2.0.5V2 83.19,11.43 R1.2 HEADER.3
B0
  Bottom 0.152: 297.81,14.58 RARROW.MX2 | 297.81,14.58 302.89,19.66 302.89,31.75 301.12,33.53 END.MX2 302.89,38.71 302.89,51.44 301.75,52.58 PGDOWN.MX2 302.89,57.76 302.89,69.22 300.48,71.63 PGUP.MX2 302.89,76.81 302.89,88.27 300.36,90.81 HOME.MX2 302.89,95.99 302.89,108.58 301.7,109.78 DELETE.MX2 | 297.81,14.58 301.02,14.58 302.89,12.7 302.89,4.45 299.72,1.27 186.21,1.27 182.88,5.71 175.26,5.71 171.3,1.27 118.75,1.27 113.03,5.71 111.12,5.71 110.49,5.08 TEENSY2.0.B0
B1
  Bottom 0.152: PAUSE.MX2 281.38,109.78 283.21,107.95 283.21,100.97 279.4,97.16 275.59,97.16 BKSPACE.MX2 274.32,90.81 283.85,85.09 283.85,38.1 UARROW.MX2 282.07,33.53 283.85,31.75 283.85,19.68 278.64,14.48 | 278.64,14.48 DARROW.MX2 | 278.64,14.48 282.07,14.48 283.85,12.7 283.85,4.45 281.31,1.91 186.84,1.91 183.51,6.35 174.62,6.35 170.66,1.91 118.75,1.91 113.03,6.35 108.58,6.35 107.95,5.71 TEENSY2.0.B1
B2
  Bottom 0.152: 259.59,14.52 LARROW.MX2 | 259.59,14.52 259.59,31.24 257.81,33.02 252.98,33.02 RSHIFT.MX2 258.32,39.37 266.06,39.37 272.42,43.18 272.42,50.16 ENTER.MX2 266.78,55.96 269.88,59.05 277.5,59.05 280.04,61.59 280.04,68.58 276.96,71.65 \\.MX2 274.32,71.65 270.62,71.65 269.24,73.03 252.09,73.03 247.01,78.11 247.01,92.71 249.56,95.25 260.35,95.25 264.16,99.06 264.16,106.05 260.45,109.75 PRTSC.MX2 | 259.59,14.52 262.97,14.52 264.8,12.7 264.8,4.45 262.89,2.54 187.48,2.54 184.15,6.99 173.99,6.99 170.03,2.54 118.75,2.54 113.03,6.99 106.68,6.99 105.41,5.71 TEENSY2.0.B2
B3
  Bottom 0.152: F12.MX2 243.92,109.78 245.75,107.95 245.75,96.01 =.MX2 243.31,90.7 245.75,88.27 245.75,76.02 ].MX2 253.49,71.63 255.27,69.85 255.27,63.5 240.66,53.98 240.66,40.64 238.12,36.83 238.12,16.89 RCTRL.MX2 240.66,14.5 243.97,14.48 245.75,12.7 245.75,5.08 243.84,3.17 188.11,3.17 184.78,7.62 173.35,7.62 169.39,3.17 118.75,3.17 113.03,7.62 105.41,7.62 104.78,6.99 104.14,5.08 TEENSY2.0.B3
B4
  Top 0.152: D115.C 279.4,81.28 278.13,82.55 267.92,82.55 267.9,82.53 250.81,82.53 D114.C D112.C D111.C D110.C D109.C D108.C D107.C D106.C D105.C D104.C D103.C D102.C D101.C 17.14,81.28 D100.C 12.7,74.93 11.43,73.66 5.71,73.66 3.17,71.12 3.17,59.69 8.89,53.98 8.89,44.45 3.81,41.27 3.81,26.67 6.25,24.77 34.92,24.77 40.01,20.95 89.53,20.95 90.17,20.32 TEENSY2.0.B4
B5
  Top 0.152: TEENSY2.0.B5 92.71,20.95 92.08,21.59 40.01,21.59 34.92,25.4 6.73,25.38 4.45,27.18 4.45,40.64 9.53,43.81 9.53,54.61 5.08,59.05 D200.C D201.C D202.C D203.C D204.C D205.C D206.C D207.C D208.C D209.C D210.C D211.C D212.C 255.27,62.23 D213.C 266.06,61.59 273.69,61.59 274.95,60.33 282.57,60.33 D215.C
B6
  Top 0.152: 52.43,43.33 D302.C | D302.C D303.C D304.C D305.C 128.14,43.31 128.91,42.55 128.91,43.05 D306.C D307.C D308.C D309.C D310.C D311.C D313.C 260.22,43.31 260.99,42.55 284.99,42.55 D315.C | 32.69,43.31 D302.C | 32.69,43.31 D301.C | 32.69,43.31 27.43,43.31 D300.C 26.67,32.38 24.45,30.17 24.45,27.62 26.04,26.04 34.93,26.04 34.94,26.02 40.01,22.23 93.98,22.23 95.25,20.32 TEENSY2.0.B6
B7
  Bottom 0.152: 221.69,14.55 FN.MX2 | 221.69,14.55 227.46,20.32 229.87,20.32 232.41,22.86 232.41,31.11 222.88,40.64 222.88,53.34 224.79,55.24 232.41,55.24 '.MX2 235.84,69.6 233.81,71.63 [.MX2 226.69,75.95 226.69,88.9 224.79,90.81 -.MX2 226.69,96.01 226.69,107.95 224.87,109.78 F11.MX2 | 221.69,14.55 225.48,14.55 226.69,13.34 226.69,5.71 224.79,3.81 188.75,3.81 185.42,8.26 173.1,8.28 168.76,3.81 118.75,3.81 113.03,8.26 100.97,8.26 100.33,7.62 TEENSY2.0.B7
C6
  Bottom 0.152: F6.MX2 129.62,109.78 131.44,107.95 131.44,95.89 6.MX2 129.54,90.81 131.44,88.9 131.44,75.95 Y.MX2 139.19,71.63 140.97,69.85 140.97,64.77 arc-90 137.79,61.59 arc90 133.35,57.15 arc90 137.92,52.58 H.MX2 143.64,52.58 145.41,50.8 145.41,38.23 N.MX2 152.5,33.55 154.94,31.11 154.94,23.5 151.13,19.68 133.99,19.68 | 133.99,19.68 127,19.68 126.36,19.05 122.56,15.88 113.03,15.88 109.22,11.43 89.53,11.43 88.27,10.16 88.27,4.45 TEENSY2.0.C6 | SBAR.MX2 133.43,19.13 133.99,19.68
C7
  Bottom 0.152: F5.MX2 110.57,109.78 112.39,107.95 112.39,95.89 5.MX2 110.49,90.81 112.39,88.9 112.39,75.95 T.MX2 120.14,71.63 121.92,69.85 121.92,52.96 G.MX2 125.22,52.58 126.36,51.44 126.36,38.23 B.MX2 132.82,33.55 135.89,30.48 135.89,23.5 132.72,20.32 127,20.32 122.56,16.51 113.03,16.51 109.22,12.06 88.9,12.06 87,10.16 87,5.71 TEENSY2.0.C7
CAPS-LED+  (via drill 0.35)
  Top 0.152: v2.31,37.41 2.54,35.56 2.54,25.83 5.66,23.5 34.92,23.5 40.01,19.68 64.14,19.68 66.67,17.14 66.67,7.62 70.48,3.81 HEADER.1
  Bottom 0.152: R1.1 HEADER.1 | v2.31,37.41 8.89,42.55 15.19,42.55 CAPSLK.LED+
D0
  Bottom 0.152: 202.59,14.5 RALT.MX2 | 202.59,14.5 209.04,20.95 229.24,20.95 231.78,23.5 231.78,31.11 229.36,33.53 /.MX2 221.62,37.72 221.62,50.16 219.84,52.58 SCOLON.MX2 217.17,52.96 217.17,69.85 215.39,71.63 P.MX2 207.65,75.95 207.65,88.9 205.74,90.81 0.MX2 207.65,96.01 207.65,107.95 205.82,109.78 F10.MX2 | 202.59,14.5 202.49,14.61 197.49,14.61 194.31,17.78 190.5,17.78 182.25,8.89 172.72,8.89 168.28,4.45 118.75,4.45 113.03,8.89 98.42,8.89 97.79,8.26 TEENSY2.0.D0
D1
  Bottom 0.152: F9.MX2 186.77,109.78 188.59,107.95 188.59,96.01 9.MX2 186.69,90.81 188.59,88.9 188.59,75.95 O.MX2 196.34,71.63 198.12,69.85 198.12,52.96 L.MX2 201.42,52.58 202.56,51.44 202.56,38.23 ..MX2 210.31,33.53 212.09,31.75 212.09,24.77 211.46,24.13 198.75,24.13 194.94,20.32 191.77,20.32 181.61,9.53 172.09,9.53 167.64,5.08 118.75,5.08 113.03,9.53 95.89,9.53 95.25,8.89 TEENSY2.0.D1
D2
  Bottom 0.152: F8.MX2 167.72,109.78 169.54,107.95 169.54,96.01 8.MX2 167.64,90.81 169.54,88.9 169.54,75.95 I.MX2 177.29,71.63 179.07,69.85 179.07,52.96 K.MX2 181.74,52.58 183.51,50.8 183.51,38.1 ,.MX2 191.26,33.53 193.04,31.75 193.04,22.86 180.97,10.16 171.45,10.16 167,5.71 118.75,5.71 113.03,10.16 93.34,10.16 92.71,9.53 TEENSY2.0.D2
D3
  Bottom 0.152: 7.MX2 149.22,90.81 150.5,89.53 150.5,76.07 U.MX2 158.24,71.63 160.02,69.85 160.02,52.96 J.MX2 162.69,52.58 164.47,50.8 164.47,38.23 M.MX2 170.94,31.75 172.72,31.75 173.99,30.48 173.99,13.97 166.37,6.35 147.32,6.35 143.51,10.16 139.7,10.16 135.89,6.35 132.19,6.35 132.17,6.33 122.44,6.33 122.42,6.35 118.75,6.35 113.03,10.79 91.44,10.79 90.17,9.78 TEENSY2.0.D3 | 7.MX2 144.78,90.81 | 7.MX2 150.5,96.01 150.5,107.95 148.67,109.78 F7.MX2
D4
  Bottom 0.152: TEENSY2.0.D4 83.19,14.61 78.74,14.61 74.93,18.41 72.39,18.41 69.22,13.97 69.22,8.89 | 69.22,8.89 64.09,3.25 64,3.17 64,3.16 62.87,1.91 2.64,1.8 1.27,3.17 1.27,34.14 9.04,40.01 15.24,40.01 17.68,42.44 CAPSLK.LED- | 69.22,8.89 HEADER.2
D5
  Top 0.152: D515.C D514.C D513.C D512.C D511.C 207.01,7.62 207.01,22.23 205.74,23.5 198.12,23.5 196.85,22.23 189.87,22.23 187.32,19.68 187.32,13.34 190.5,10.16 D510.C 187.96,8.89 172.72,8.89 171.45,7.62 D506.C 136.92,7.62 135.63,6.33 122.54,6.33 117.47,1.91 84.75,1.91 83.33,3.32 83.33,5.23 TEENSY2.0.D5 82.55,6.35 82.15,5.95 79.61,5.95 76.83,1.91 71.75,1.91 68.34,4.05 65.52,4.05 62.74,1.91 29.84,1.91 D502.C D501.C D500.C
D7
  Top 0.152: D010.C D009.C D008.C D007.C D006.C D005.C D004.C D003.C D002.C D001.C 15.88,100.33 D000.C 10.79,93.98 9.53,92.71 4.45,92.71 2.54,90.81 2.54,59.05 8.26,53.34 8.26,45.09 3.17,41.91 3.15,26.24 5.97,24.13 34.92,24.13 40.01,20.32 87,20.32 TEENSY2.0.D7 | D010.C 191.13,100.33 | D010.C D011.C D012.C D013.C 266.06,100.33 266.7,100.97 D014.C D015.C
F0
  Bottom 0.152: TEENSY2.0.F0 113.03,22.23 114.94,22.23 116.84,24.13 116.84,31.75 115.06,33.53 V.MX2 107.31,38.23 107.31,50.8 105.54,52.58 F.MX2 102.87,52.96 102.87,69.85 101.09,71.63 R.MX2 93.34,75.95 93.34,88.9 91.44,90.81 4.MX2 93.34,95.89 93.34,107.95 91.52,109.78 F4.MX2
F1
  Bottom 0.152: 92.37,33.53 C.MX2 | C.MX2 96.01,33.53 97.79,31.75 97.79,22.23 106.68,22.23 108.58,20.32 TEENSY2.0.F1 | C.MX2 88.27,38.23 88.27,50.16 85.85,52.58 D.MX2 83.19,52.83 83.19,69.85 81.41,71.63 E.MX2 74.3,75.95 74.3,88.9 72.39,90.81 3.MX2 74.3,95.89 74.3,107.95 72.47,109.78 F3.MX2
F4
  Bottom 0.152: 78.74,21.59 104.78,21.59 106.05,20.32 TEENSY2.0.F4 | 78.74,21.59 64.77,21.59 62.08,19.53 62.1,14.61 LALT.MX2 | 78.74,21.59 78.74,31.75 76.94,33.55 X.MX2 69.22,38.23 69.22,50.8 67.44,52.58 S.MX2 64.77,52.96 64.77,69.85 62.99,71.63 W.MX2 55.24,75.95 55.24,88.9 53.34,90.81 2.MX2 55.24,95.89 55.24,107.95 53.42,109.78 F2.MX2
F5
  Bottom 0.152: 55.34,17.87 55.29,17.92 | 55.34,17.87 41.37,17.87 WIN.MX2 | 55.34,17.87 59.69,22.23 59.69,31.75 57.91,33.53 Z.MX2 50.16,38.1 | 50.16,38.1 50.16,50.8 48.39,52.58 A.MX2 45.72,52.96 45.72,68.58 42.67,71.63 Q.MX2 35.05,71.63 arc-90 30.48,76.2 arc-90 35.56,81.28 36.2,81.28 36.2,88.9 34.29,90.81 1.MX2 36.2,96.01 36.2,108.58 35,109.78 F1.MX2 | 45.62,33.55 50.16,38.1 | TEENSY2.0.F5 102.87,20.32 102.23,20.95 72.39,20.95 66.04,12.06 61.17,12.06 55.34,17.87
F6
  Bottom 0.152: 19.44,52.95 CAPSLK.MX2 | 19.44,52.95 22.86,56.39 22.86,68.58 19.81,71.63 TAB.MX2 17.14,72.01 17.14,88.9 15.24,90.81 `.MX2 17.14,95.89 17.14,107.31 14.68,109.78 ESC.MX2 | 19.44,52.95 25.01,52.95 26.04,53.98 27.94,53.98 29.21,52.7 29.21,38.86 LSHIFT.MX2 23.16,34.29 14.61,34.29 12.06,31.11 12.06,26.67 14.35,21.84 LCTRL.MX2 16.64,14.48 21.59,10.16 21.59,3.81 22.86,2.54 62.87,2.54 68.58,8.89 68.58,13.97 73.03,20.32 100.33,20.32 TEENSY2.0.F6
F7
  Top 0.152: D415.C D414.C D413.C D410.C D409.C D408.C D407.C D406.C D405.C D404.C | D404.C 99.69,20.95 TEENSY2.0.F7 | D404.C D403.C D402.C D401.C 41.91,24.13 40.64,24.77 40.01,27.05 D400.C
GND  (via drill 0.35)
  other vias: 214.63,18.41 175.9,2.54
  pour Top (isolate 0.305): 0,114.3 0,0 304.8,0 304.8,114.3
  pour Bottom (isolate 0.305): 0,114.3 0,0 304.8,0 304.8,114.3
N$1
  Bottom 0.152: D000.A 1.91,96.52 1.91,106.68 2.54,107.31 ESC.MX1
N$2
  Bottom 0.152: F1.MX1 24,107.95 D001.A
N$3
  Bottom 0.152: F2.MX1 43.05,107.95 D002.A
N$4
  Bottom 0.152: HOME.MX1 290.7,88.9 D115.A
N$5
  Bottom 0.152: F3.MX1 62.23,107.95 D003.A
N$6
  Bottom 0.152: F4.MX1 81.15,107.95 D004.A
N$7
  Bottom 0.152: D100.A 1.91,80.64 1.91,87 2.54,88.27 `.MX1
N$8
  Bottom 0.152: F11.MX1 214.5,107.95 D011.A
N$9
  Bottom 0.152: F5.MX1 100.2,107.95 D005.A
N$10
  Bottom 0.152: F6.MX1 119.38,107.95 D006.A
N$11
  Bottom 0.152: F7.MX1 138.18,107.95 D007.A
N$12
  Bottom 0.152: F8.MX1 157.23,107.95 D008.A
N$13
  Bottom 0.152: F9.MX1 176.4,107.95 D009.A
N$14
  Bottom 0.152: PRTSC.MX1 252.73,107.95 D013.A
N$15
  Bottom 0.152: F10.MX1 195.58,107.95 D010.A
N$16
  Bottom 0.152: 1.MX1 24,88.9 D101.A
N$17
  Bottom 0.152: F12.MX1 233.43,107.95 D012.A
N$18
  Bottom 0.152: PAUSE.MX1 271.65,107.95 D014.A
N$19
  Bottom 0.152: D102.A 43.05,88.9 2.MX1
N$20
  Bottom 0.152: DELETE.MX1 290.83,107.95 D015.A
N$21
  Bottom 0.152: 3.MX1 62.23,88.9 D103.A
N$22
  Bottom 0.152: 7.MX1 138.18,88.9 D107.A
N$23
  Bottom 0.152: 4.MX1 81.28,88.9 D104.A
N$24
  Bottom 0.152: 5.MX1 100.2,88.9 D105.A
N$25
  Bottom 0.152: 6.MX1 119.25,88.9 D106.A
N$26
  Bottom 0.152: 8.MX1 157.23,88.9 D108.A
N$27
  Bottom 0.152: 9.MX1 176.28,88.9 D109.A
N$28
  Bottom 0.152: 0.MX1 195.33,88.9 D110.A
N$29
  Bottom 0.152: -.MX1 214.38,88.9 D111.A
N$30
  Bottom 0.152: =.MX1 233.43,88.9 D112.A
N$31
  Bottom 0.152: BKSPACE.MX1 262.13,88.9 D114.A
N$32
  Bottom 0.152: Q.MX1 33.4,69.85 D201.A
N$33
  Bottom 0.152: TAB.MX1 9.65,69.85 D200.A
N$35
  Bottom 0.152: K.MX1 171.58,50.93 D308.A
N$36
  Bottom 0.152: W.MX1 52.45,69.85 D202.A
N$37
  Bottom 0.152: S.MX1 57.15,50.93 D302.A
N$38
  Bottom 0.152: A.MX1 38.08,50.95 D301.A
N$39
  Bottom 0.152: D402.A 66.8,31.75 X.MX1
N$40
  Bottom 0.152: D401.A 47.62,31.75 Z.MX1
N$42
  Bottom 0.152: D403.A 85.85,31.75 C.MX1
N$43
  Bottom 0.152: F.MX1 95.38,50.93 D304.A
N$44
  Bottom 0.152: R.MX1 90.55,69.85 D204.A
N$45
  Bottom 0.152: D404.A 104.9,31.75 V.MX1
N$46
  Bottom 0.152: D405.A 123.95,31.75 B.MX1
N$47
  Bottom 0.152: G.MX1 114.3,50.93 D305.A
N$48
  Bottom 0.152: D303.A 71.55,50.88 76.38,50.88 D.MX1
N$49
  Bottom 0.152: T.MX1 109.6,69.85 D205.A
N$50
  Bottom 0.152: Y.MX1 128.65,69.85 D206.A
N$51
  Bottom 0.152: U.MX1 147.83,69.85 D207.A
N$52
  Bottom 0.152: J.MX1 152.4,50.93 D307.A
N$53
  Bottom 0.152: D407.A 162.81,31.75 M.MX1
N$54
  Bottom 0.152: D406.A 143.76,31.75 N.MX1
N$55
  Bottom 0.152: H.MX1 133.35,50.93 D306.A
N$56
  Bottom 0.152: I.MX1 166.75,69.85 D208.A
N$57
  Bottom 0.152: O.MX1 185.8,69.85 D209.A
N$58
  Bottom 0.152: L.MX1 190.5,50.93 D309.A
N$59
  Bottom 0.152: D409.A 200.91,31.75 ..MX1
N$60
  Bottom 0.152: D408.A 181.74,31.75 ,.MX1
N$61
  Bottom 0.152: D410.A 220.09,31.75 /.MX1
N$62
  Bottom 0.152: SCOLON.MX1 209.55,50.93 D310.A
N$63
  Bottom 0.152: P.MX1 204.85,69.85 D210.A
N$64
  Bottom 0.152: D211.A 223.9,69.85 arc-90 [.MX1
N$65
  Bottom 0.152: '.MX1 228.6,50.93 D311.A
N$66
  Bottom 0.152: LSHIFT.MX1 19.53,31.01 20.08,31.57 22.64,31.57 23.09,31.11 24.77,31.11 33.76,31.22 D400.A
N$67
  Bottom 0.152: ].MX1 242.95,69.85 D212.A
N$68
  Bottom 0.152: D213.A 255.91,59.05 256.54,59.69 262.25,59.69 263.52,60.96 263.52,62.87 267.97,64.77 267.97,65.47 268.27,65.77 268.27,68.43 \\.MX1
N$69
  Bottom 0.152: D313.A 244.47,49.53 244.47,44.45 245.75,43.18 259.71,43.18 261.06,44.48 261.06,48.28 ENTER.MX1
N$70
  Bottom 0.152: PGUP.MX1 290.58,69.85 D215.A
N$71
  Bottom 0.152: PGDOWN.MX1 290.45,50.93 D315.A
N$72
  Bottom 0.152: D415.A 291.36,31.75 END.MX1
N$73
  Bottom 0.152: D414.A 272.29,31.75 UARROW.MX1
N$74
  Bottom 0.152: D515.A 290.02,13.34 RARROW.MX1
N$75
  Bottom 0.152: D514.A 270.97,13.34 DARROW.MX1
N$76
  Bottom 0.152: D513.A 251.92,13.34 LARROW.MX1
N$77
  Bottom 0.152: D413.A 246.13,31.75 RSHIFT.MX1
N$78
  Bottom 0.152: D512.A 232.87,13.34 RCTRL.MX1
N$79
  Bottom 0.152: D511.A 213.82,13.34 FN.MX1
N$80
  Bottom 0.152: 196.22,12.7 RALT.MX1 194.18,13.97 D510.A
N$81
  Bottom 0.152: CAPSLK.MX1 13.3,50.62 17.84,50.62 18.29,50.16 22.23,50.16 22.86,50.8 D300.A
N$84
  Bottom 0.152: E.MX1 71.63,69.85 D203.A
N$85
  Top 0.152: HEADER.6 76.2,16.51 78.74,13.97 83.82,13.97 83.82,17.78 TEENSY2.0.D6
N$86
  Top 0.152: TEENSY2.0.E6 97.16,12.7 77.47,12.7 76.2,13.97 HEADER.5
N$87
  Bottom 0.152: D500.A 8,12.7 8,12.06 | LCTRL.MX1 8,12.06 | 8.1,11.96 8,12.06
N$88
  Bottom 0.152: 31.81,12.14 31.75,12.7 | 31.81,12.14 WIN.MX1 | D501.A 23.5,11.43 24.77,10.16 27.3,10.16 29.21,12.06 31.74,12.06 31.81,12.14
N$89
  Top 0.152: LALT.MX1 44.96,11.96 40.52,16.4 28.06,16.4 27.93,16.53 26.67,15.26 D502.A
N$90
  Bottom 0.152: D506.A 139.06,15.24 135.89,12.06 132.62,12.06 132.17,12.52 127.63,12.52 SBAR.MX1

### Text on the board
tDocu: Detroit Keyboard Co. K84 v1.2
bDocu: GROUD THYSELF! | Detroit Keyboard Co. K84 v1.2 | D6 / / E6 / / GND / / 5V+ / / Capslock LED - / / Capslocak LED +